# Altium project PCB_Project1.PrjPCB
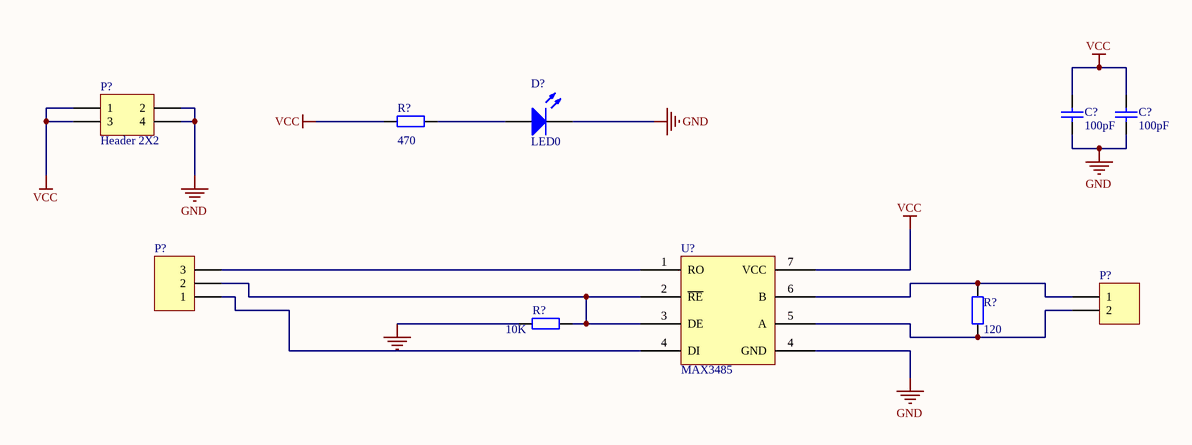
[diagram p0: Sheet1.SchDoc]
1 sheet, 10 parts. Net scope: global (net labels, ports and power ports of the same name join across sheets).
Board file: MAX3485.PcbDoc

## Sheet Sheet1.SchDoc
size A4

### Parts
C1  value 100pF  [C0805]  (hidden comment: Cap)
C2  value 100pF  [C0805]  (hidden comment: Cap)
D1  LED0  [C0805]
P1  Header 2X2  [HDR2X2]
P2  Header 3  [HDR1X3]  (value not drawn)
P3  Header 2  [HDR1X2]  (value not drawn)
R1  value 470  [C0805]  (hidden comment: Res2)
R2  value 120  [C0805]  (hidden comment: Res2)
R3  value 10K  [C0805]  (hidden comment: Res2)
U?  MAX3485

### Nets
GND: C1.1 C2.1 D1.2(K) P1.2 P1.4 R3.1 U?.4(GND)
VCC: C1.2 C2.2 P1.1 P1.3 R1.1 U?.7(VCC)
NetD1_1: D1.1(A) R1.2
NetP2_1: P2.1 U?.4(DI)
NetP2_2: P2.2 R3.2 U?.2(~{RE}) U?.3(DE)
NetP2_3: P2.3 U?.1(RO)
NetP3_1: P3.1 R2.2 U?.6(B)
NetP3_2: P3.2 R2.1 U?.5(A)

### Library data of the parts
C1 C2 = Cap: Capacitor; Published: 8-Jun-2000; LatestRevisionDate: 17-Jul-2002; LatestRevisionNote: Re-released for DXP Platform.; PackageReference: RAD-0.3; Publisher: Altium Limited
D1 = LED0: Typical INFRARED GaAs LED; Published: 8-Jun-2000; LatestRevisionDate: 08-Jul-2005; LatestRevisionNote: Mech Layer 1 removed.; PackageReference: LED-0; Publisher: Altium Limited
P1 = Header 2X2: Header, 2-Pin, Dual row; LatestRevisionDate: 17-Jul-2002; LatestRevisionNote: Re-released for DXP Platform.; Publisher: Altium Limited
P2 = Header 3: Header, 3-Pin; LatestRevisionDate: 17-Jul-2002; LatestRevisionNote: Re-released for DXP Platform.; Publisher: Altium Limited
P3 = Header 2: Header, 2-Pin; LatestRevisionDate: 17-Jul-2002; LatestRevisionNote: Re-released for DXP Platform.; Publisher: Altium Limited
R1-R3 = Res2: Resistor; Published: 8-Jun-2000; LatestRevisionDate: 17-Jul-2002; LatestRevisionNote: Re-released for DXP Platform.; PackageReference: AXIAL-0.4; Publisher: Altium Limited
U? = Component_1